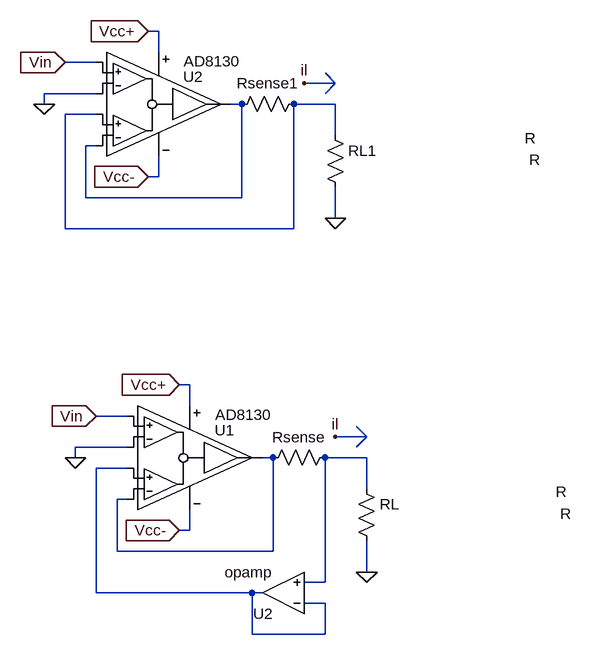
[diagram p0: schematic Fontes_de_corrente_AD8130.asc]
Fontes_de_corrente_AD8130.asc, the LTspice schematic file:
Version 4
SHEET 1 1168 680
WIRE -48 -464 -64 -464
WIRE -48 -432 -48 -464
WIRE -144 -416 -192 -416
WIRE -144 -368 -224 -368
WIRE -224 -352 -224 -368
WIRE 80 -352 64 -352
WIRE 224 -352 160 -352
WIRE -144 -336 -192 -336
WIRE 224 -304 224 -352
WIRE -144 -288 -160 -288
WIRE -48 -240 -48 -272
WIRE -48 -240 -64 -240
WIRE -160 -208 -160 -288
WIRE 80 -208 80 -352
WIRE 80 -208 -160 -208
WIRE 224 -176 224 -224
WIRE -192 -160 -192 -336
WIRE 160 -160 160 -352
WIRE 160 -160 -192 -160
WIRE 0 80 -16 80
WIRE 0 112 0 80
WIRE -96 128 -144 128
WIRE -96 176 -176 176
WIRE -176 192 -176 176
WIRE 128 192 112 192
WIRE 272 192 208 192
WIRE -96 208 -144 208
WIRE 272 240 272 192
WIRE -96 256 -112 256
WIRE 0 304 0 272
WIRE 0 304 -16 304
WIRE -112 336 -112 256
WIRE 128 336 128 192
WIRE 128 336 -112 336
WIRE 272 368 272 320
WIRE 208 384 208 192
WIRE 208 384 176 384
WIRE -144 400 -144 208
WIRE 96 400 -144 400
WIRE 112 400 96 400
WIRE 208 416 176 416
WIRE 96 464 96 400
WIRE 208 464 208 416
WIRE 208 464 96 464
FLAG -16 80 Vcc+
IOPIN -16 80 In
FLAG -16 304 Vcc-
IOPIN -16 304 In
FLAG -176 192 0
FLAG -144 128 Vin
IOPIN -144 128 In
FLAG 272 368 0
FLAG 224 160 il
FLAG -64 -464 Vcc+
IOPIN -64 -464 In
FLAG -64 -240 Vcc-
IOPIN -64 -240 In
FLAG -224 -352 0
FLAG -192 -416 Vin
IOPIN -192 -416 In
FLAG 224 -176 0
FLAG 176 -384 il
SYMBOL AD8130 -16 192 R0
WINDOW 0 54 -42 Left 2
WINDOW 3 55 -66 Left 2
SYMATTR InstName U1
SYMATTR Description Behavioral Sample and Hold function block
SYMBOL res 224 176 R90
WINDOW 0 0 56 VBottom 2
WINDOW 3 53 -348 VTop 2
SYMATTR InstName Rsense
SYMBOL res 256 224 R0
WINDOW 3 314 54 Left 2
SYMATTR InstName RL
SYMBOL AD8130 -64 -352 R0
WINDOW 0 54 -42 Left 2
WINDOW 3 55 -66 Left 2
SYMATTR InstName U2
SYMATTR Description Behavioral Sample and Hold function block
SYMBOL res 176 -368 R90
WINDOW 0 0 56 VBottom 2
WINDOW 3 53 -348 VTop 2
SYMATTR InstName Rsense1
SYMBOL res 208 -320 R0
WINDOW 3 314 54 Left 2
SYMATTR InstName RL1
SYMBOL Opamps\\opamp 144 464 R180
SYMATTR InstName U2
LINE Normal 240 192 240 192 2
LINE Normal 240 192 240 192 2
LINE Normal 272 160 224 160
LINE Normal 256 144 272 160
LINE Normal 272 160 256 144
LINE Normal 256 176 272 160
LINE Normal 256 176 256 176
LINE Normal 192 -352 192 -352 2
LINE Normal 192 -352 192 -352 2
LINE Normal 224 -384 176 -384
LINE Normal 208 -400 224 -384
LINE Normal 224 -384 208 -400
LINE Normal 208 -368 224 -384
LINE Normal 208 -368 208 -368

The netlist it stands for:
* Fontes_de_corrente_AD8130.asc
XU1 Vin 0 N005 N003 Vcc+ Vcc- N003 AD8130  ; pins 1 2 3 4 99 50 45
Rsense N004 N003 R
RL N004 0 R
XU2 Vin 0 N002 N001 Vcc+ Vcc- N001 AD8130  ; pins 1 2 3 4 99 50 45
Rsense1 N002 N001 R
RL1 N002 0 R
XU2 N005 N004 N005 opamp Aol=100K GBW=10Meg  ; pins invin noninvin out
.lib .\ad8130.cir
.backanno
.end